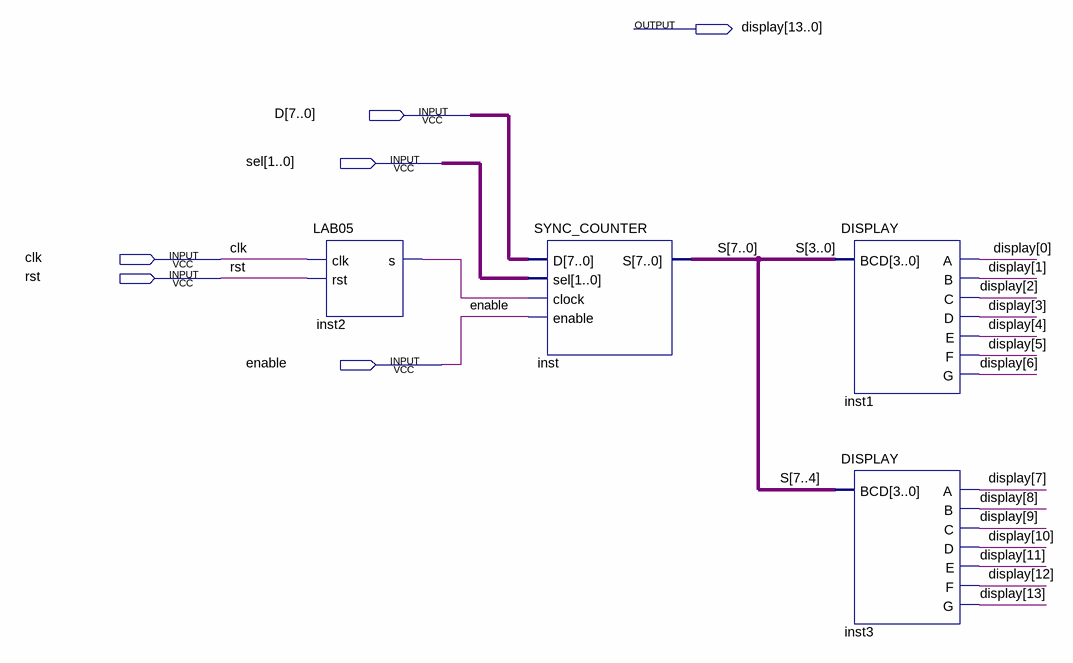
[diagram p0: schematic sheet]
// Quartus schematic SYNC_COUNTER_DISPLAY.bdf as structural Verilog: 4 symbols, 6 pins
module SYNC_COUNTER_DISPLAY (
  input  [7:0] D,
  input  [1:0] sel,
  input  clk,
  input  rst,
  input  enable,
  output [13:0] display
);

  wire inst2_s;
  wire [7:0] S;

  LAB05 inst2 (.clk(clk), .rst(rst), .s(inst2_s));
  SYNC_COUNTER inst (.D(D), .sel(sel), .clock(inst2_s), .enable(enable), .S(S));
  DISPLAY inst1 (
    .BCD(S[3:0]), .A(display[0]), .B(display[1]), .C(display[2]), .D(display[3]), .E(display[4]),
    .F(display[5]), .G(display[6]));
  DISPLAY inst3 (
    .BCD(S[7:4]), .A(display[7]), .B(display[8]), .C(display[9]), .D(display[10]), .E(display[11]),
    .F(display[12]), .G(display[13]));
endmodule
